# Altium schematic sheet MCU+ADC.SchDoc
size A3
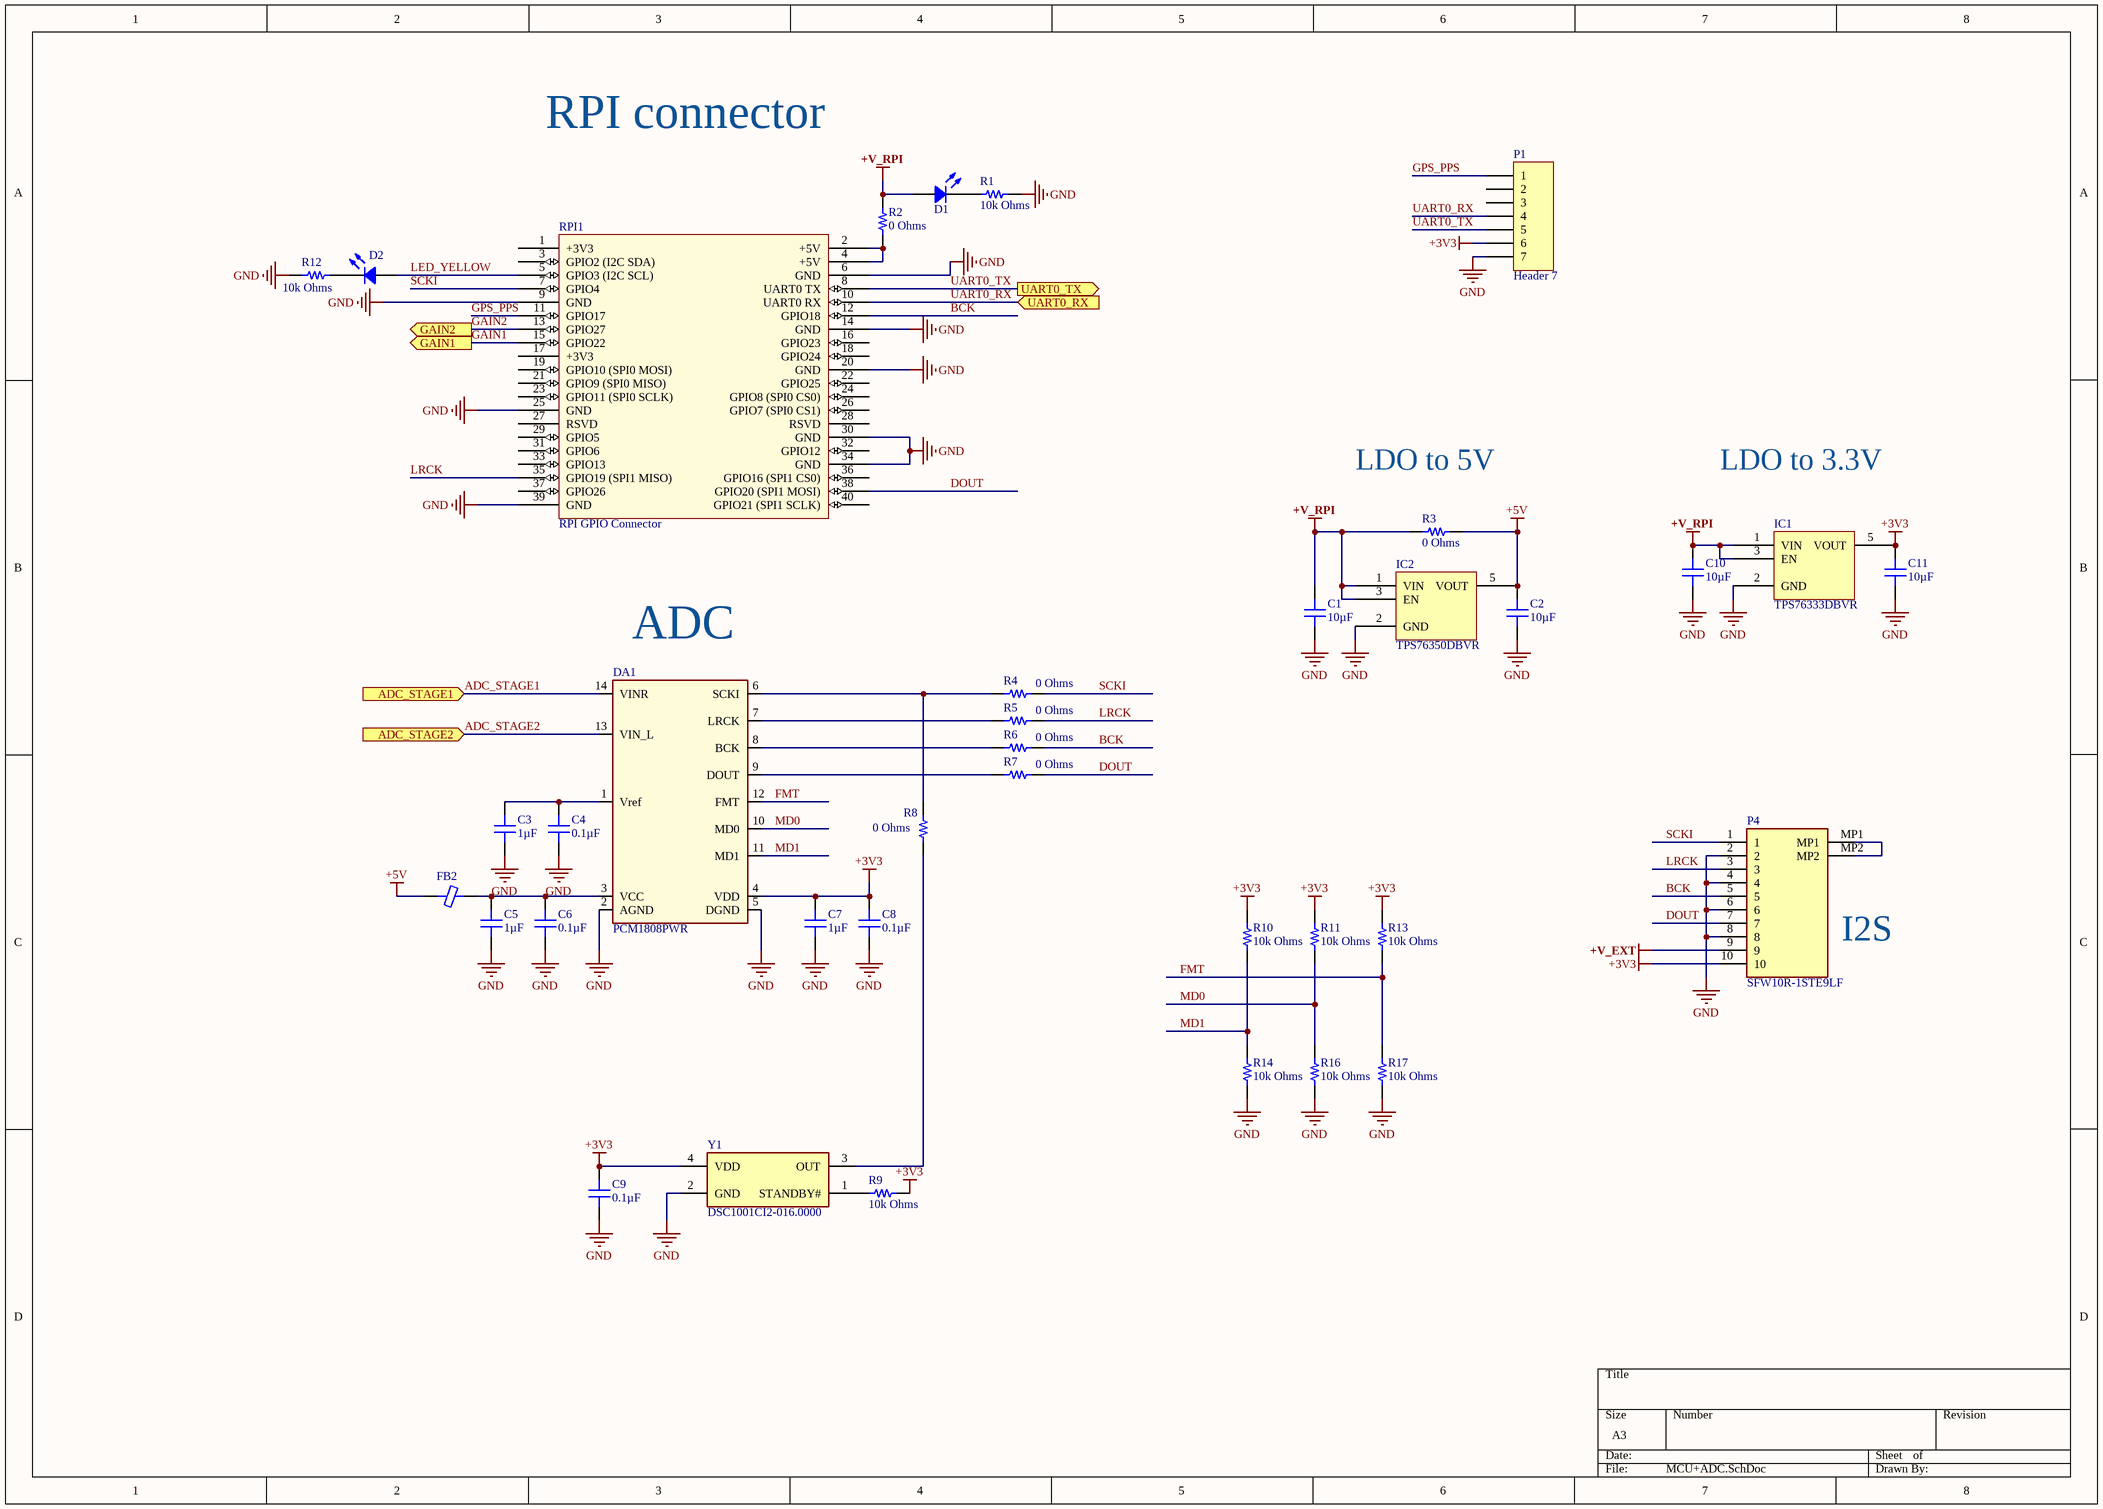
[diagram p0: MCU+ADC.SchDoc]

## Parts
C1  10µF  [CAP 0603_1608]
C2  10µF  [CAP 0603_1608]
C3  1µF  [CAP 0603_1608]
C4  0.1µF  [CAP 0603_1608]
C5  1µF  [CAP 0603_1608]
C6  0.1µF  [CAP 0603_1608]
C7  1µF  [CAP 0603_1608]
C8  0.1µF  [CAP 0603_1608]
C9  0.1µF  [CAP 0603_1608]
C10  10µF  [CAP 0603_1608]
C11  10µF  [CAP 0603_1608]
D1  (no value)  [LED 0603_1608 RED]
D2  (no value)  [LED 0603_1608 YELLOW]
DA1  PCM1808PWR  [TSSOP 14]
FB2  (no value)  [FER 0603_1608]
IC1  TPS76333DBVR  [TI SOT-23-5 DBV]
IC2  TPS76350DBVR  [TI SOT-23-5 DBV]
P1  Header 7  [HDR1X7]
P4  SFW10R-1STE9LF  [SFW10R1STE9LF]
R1  10k Ohms  [RES 0603_1608]
R2  0 Ohms  [RES 1206_3216]
R3  0 Ohms  [RES 0603_1608]
R4  0 Ohms  [RES 0603_1608]
R5  0 Ohms  [RES 0603_1608]
R6  0 Ohms  [RES 0603_1608]
R7  0 Ohms  [RES 0603_1608]
R8  0 Ohms  [RES 0603_1608]
R9  10k Ohms  [RES 0603_1608]
R10  10k Ohms  [RES 0603_1608]
R11  10k Ohms  [RES 0603_1608]
R12  10k Ohms  [RES 0603_1608]
R13  10k Ohms  [RES 0603_1608]
R14  10k Ohms  [RES 0603_1608]
R16  10k Ohms  [RES 0603_1608]
R17  10k Ohms  [RES 0603_1608]
RPI1  RPI GPIO Connector  [rpi]
Y1  DSC1001CI2-016.0000  [DSC1001CI20160000]

## Ports
ADC_STAGE1 (in), ADC_STAGE2 (in), GAIN1 (out), GAIN2 (out), UART0_RX (in), UART0_TX (out)

## Nets
+3V3: C7.2 C8.2 C9.2 C11.2 DA1.4(VDD) IC1.5(VOUT) P1.6 P4.10 R9.1 R10.1 R11.1 R13.1 Y1.4(VDD)
+5V: C2.2 FB2.1 IC2.5(VOUT) R3.1
+V_EXT: P4.9
+V_RPI: C1.2 C10.2 D1.1 IC1.1(VIN) IC1.3(EN) IC2.1(VIN) IC2.3(EN) R2.2 R3.2
GND: C1.1 C2.1 C3.1 C4.1 C5.1 C6.1 C7.1 C8.1 C9.1 C10.1 C11.1 DA1.2(AGND) DA1.5(DGND) IC1.2(GND) IC2.2(GND) P1.7 P4.2 P4.4 P4.6 P4.8 R1.1 R12.1 R14.2 R16.2 R17.2 RPI1.6(GND) RPI1.9(GND) RPI1.14(GND) RPI1.20(GND) RPI1.25(GND) RPI1.30(GND) RPI1.34(GND) RPI1.39(GND) Y1.2(GND)
ADC_STAGE1: DA1.14(VINR) ; port ADC_STAGE1
ADC_STAGE2: DA1.13(VIN_L) ; port ADC_STAGE2
BCK: P4.5 R6.1 RPI1.12(GPIO18)
DOUT: P4.7 R7.1 RPI1.38(GPIO20_(SPI1_MOSI))
FMT: DA1.12(FMT) R13.2 R17.1
GAIN1: RPI1.15(GPIO22) ; port GAIN1
GAIN2: RPI1.13(GPIO27) ; port GAIN2
GPS_PPS: P1.1 RPI1.11(GPIO17)
LED_YELLOW: D2.1 RPI1.5(GPIO3_(I2C_SCL))
LRCK: P4.3 R5.1 RPI1.35(GPIO19_(SPI1_MISO))
MD0: DA1.10(MD0) R11.2 R16.1
MD1: DA1.11(MD1) R10.2 R14.1
SCKI: P4.1 R4.1 RPI1.7(GPIO4)
UART0_RX: P1.4 RPI1.10(UART0_RX) ; port UART0_RX
UART0_TX: P1.5 RPI1.8(UART0_TX) ; port UART0_TX
NetC3_2: C3.2 C4.2 DA1.1(Vref)
NetC5_2: C5.2 C6.2 DA1.3(VCC) FB2.2
NetD1_2: D1.2 R1.2
NetD2_2: D2.2 R12.2
NetDA1_6: DA1.6(SCKI) R4.2 R8.1
NetDA1_7: DA1.7(LRCK) R5.2
NetDA1_8: DA1.8(BCK) R6.2
NetDA1_9: DA1.9(DOUT) R7.2
NetP4_MP1: P4.MP1 P4.MP2
NetR2_1: R2.1 RPI1.2(+5V) RPI1.4(+5V)
NetR8_2: R8.2 Y1.3(OUT)
NetR9_2: R9.2 Y1.1(STANDBY#)

Not connected (* = marked no-connect by the designer): P1 2 3; RPI1 1(+3V3) 3(GPIO2_(I2C_SDA)) 16(GPIO23) 17(+3V3) 18(GPIO24) 19(GPIO10_(SPI0_MOSI)) 21(GPIO9_(SPI0_MISO)) 22(GPIO25) 23(GPIO11_(SPI0_SCLK)) 24(GPIO8_(SPI0_CS0)) 26(GPIO7_(SPI0_CS1)) 27(RSVD) 28(RSVD) 29(GPIO5) 31(GPIO6) 32(GPIO12) 33(GPIO13) 36(GPIO16_(SPI1_CS0)) 37(GPIO26) 40(GPIO21_(SPI1_SCLK))

## Notes on the sheet
- RPI connector
- LDO to 5V
- LDO to 3.3V
- (near DA1) ADC
- (near P4) I2S

## Library data of the parts
C1-C11 = 100X14W104MV4T: CAP CER 0.1UF 10V X7R 0603; Part Number: 100X14W104MV4T
  C1 C2 C10 C11: Value: 10µF
  C3 C5 C7: Value: 1µF
  C4 C6 C8 C9: Value: 0.1µF
D1 = 5973005507F: LED RED 0603 SMD; Part Number: 5973005507F
D2 = 5973408507F: LED YELLOW 0603 SMD; Part Number: 5973408507F
DA1 = PCM1808PWR: Audio ADC, 24 bit, 192 kHz; Manufacturer: Texas Instruments; Vcc min: 3.3V; Vcc max: 5V; Комментарий: АЦП, аудио назначения, 24 bit, 192 kHz; ID: PCM1808PWR; Type: ADC, audio; Temperature: -40…+85; Manufacturer P/N: PCM1808PWR; Digikey p/n: 296-26307-1-ND; Корпус: TSSOP 14
FB2 = 2506031217H0: FERRITE BEAD 0603 1LN; Part Number: 2506031217H0
IC1 = TPS76333DBVR: IC REG LINEAR 3.3V 150MA SOT23-5; Part Number: TPS76333DBVR
IC2 = TPS76350DBVR: IC REG LINEAR 5V 150MA SOT23-5; Manufacturer: Texas Instruments; Control Features: Enable; Current - Quiescent (Iq): 100µA; Current - Supply (Max): 140µA; Number of Regulators: 1; Output Configuration: Positive; Output Type: Fixed; Protection Features: Over Current, Over Temperature, Reverse Polarity; PSRR: 60dB (1kHz); Voltage Dropout (Max): 0.3V @ 150mA; Voltage - Input (Max): 10V; Part Number: TPS76350DBVR; ComponentLink1Description: Datasheet; ComponentLink1URL: http://www.ti.com/general/docs/suppproductinfo.tsp?distId=10&gotoUrl=http%3A%2F%2Fwww.ti.com%2Flit%2Fgpn%2Ftps763; ComponentLink2Description: DigiKey Link; ComponentLink2URL: http://digikey.com/product-detail/en/texas-instruments/TPS76350DBVR/296-11023-1-ND/477325; Current - Output: 150mA; LastUpdated: 02.09.2020 1:24:38; Lifecycle Status: Active; Minimum Order: 1; Mounting Type: Surface Mount; Operating Temperature: -40°C ~ 125°C; Package / Case: SC-74A, SOT-753; Packaging: TapeAndReel; Part Status: Active; Price: 0.33; Series: -; Supplier 1: DigiKey; Supplier Part Number 1: 296-11023-1-ND; Supplier Device Package: SOT-23-5; Voltage - Output (Min/Fixed): 5V
P1 = Header 7: Header, 7-Pin; LatestRevisionDate: 17-Jul-2002; LatestRevisionNote: Re-released for DXP Platform.; Publisher: Altium Limited
P4 = SFW10R-1STE9LF: Connector; Manufacturer_Name: Amphenol; Datasheet Link: http://uk.rs-online.com/web/p/products/1708742; Height: 2.7mm; Manufacturer_Part_Number: SFW10R-1STE9LF; Mouser Part Number: 649-SFW10R-1STE9LF; Mouser Price/Stock: https://www.mouser.co.uk/ProductDetail/Amphenol-FCI/SFW10R-1STE9LF/?qs=0%2FIPJkn5eAy46aTtkIWKXg%3D%3D
R1 R3-R14 R16 R17 = RNCS0603BKE100R: RES 100 OHM 0.1% 1/16W 0603; Part Number: RNCS0603BKE100R
  R1 R9-R14 R16 R17: Value: 10k Ohms
  R3-R8: Value: 0 Ohms
R2 = URG3216L-3500-L-T05: 1206 SIZE, 0.25W, 350 OHM, 0.01%; Manufacturer: Susumu; Power (Watts): 0.25W, 1/4W; Resistance: 350 Ohms; Temperature Coefficient: ±2ppm/°C; Part Number: URG3216L-3500-L-T05; ComponentLink1Description: Datasheet; ComponentLink1URL: https://www.susumu.co.jp/common/pdf/n_catalog_partition03_en.pdf; ComponentLink2Description: DigiKey Link; ComponentLink2URL: http://digikey.com/product-detail/en/susumu/URG3216L-3500-L-T05/408-2057-1-ND/9919091; Composition: Thin Film; Device Package: 1206 (3216 Metric); Features: Anti-Sulfur, Automotive AEC-Q200; Height - Seated (Max): 0.022" (0.55mm); LastUpdated: 02/09/2020 01:12:47; Lifecycle Status: Active; Minimum Order: 1; Number of Terminations: 2; Operating Temperature: -55°C ~ 155°C; Package / Case: 1206 (3216 Metric); Packaging: TapeAndReel; PartId: 36368; Part Status: Active; Price: 4.95; Ratings: AEC-Q200; Series: URG; Size / Dimension: 0.126" L x 0.063" W (3.20mm x 1.60mm); Supplier 1: DigiKey; Supplier Part Number 1: 408-2057-1-ND; Supplier Device Package: 1206; Tolerance: ±0.01%; Value: 0 Ohms
RPI1 = rpi connector: GPIO Header for Raspberry Pi A+/B+/Pi 2/Pi 3 - 2x20; Manufacturer: SparkFun Electronics; Manufacturer Part Number: PRT-14017; Nils Minor: author; nilsminor@web.de: mail; RoHS: RoHS Compliant; Category: Development Boards, Kits, Programmers; Stock 1: 150; Pricing 1: 1=1.84 (EUR); Part Status: Active; Accessory Type: Connector; For Use With/Related Products: Raspberry Pi; ComponentLink1URL: https://cdn.sparkfun.com/datasheets/Dev/RaspberryPi/12313.pdf; ComponentLink1Description: https://cdn.sparkfun.com/datasheets/Dev/RaspberryPi/12313.pdf; Supplier 1: Digi-Key; Supplier Part Number 1: 1568-1462-ND
Y1 = DSC1001CI2-016.0000: Crystal or Oscillator; Manufacturer_Name: Microchip; Datasheet Link: https://ww1.microchip.com/downloads/en/DeviceDoc/20005529B.pdf; Height: 0.9mm; Manufacturer_Part_Number: DSC1001CI2-016.0000